# Altium schematic sheet BLE.SchDoc
size A; SheetNumber: 5; SheetTotal: 5
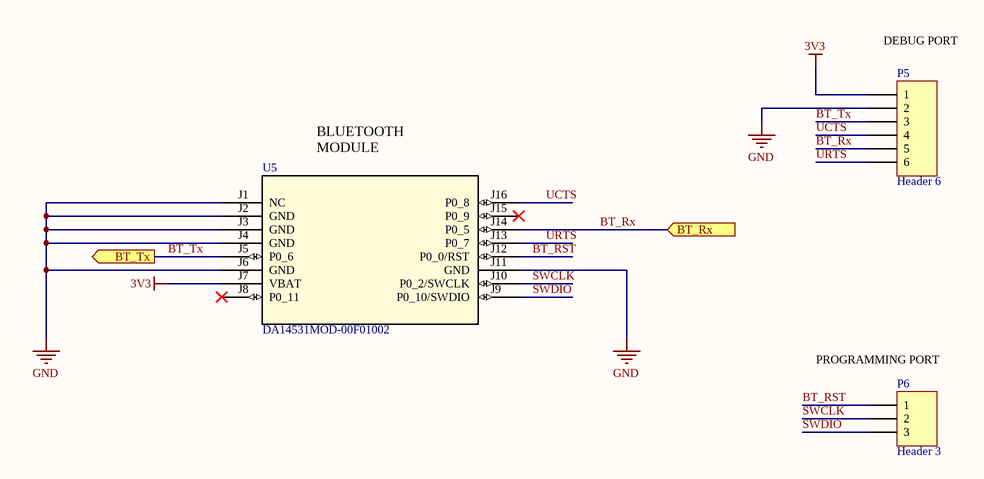
[diagram p0: BLE.SchDoc]

## Parts
P5  Header 6  [HDR1X6]
P6  Header 3  [HDR1X3]
U5  DA14531MOD-00F01002  [DA14531MOD_REN]

## Ports
BT_Rx (in), BT_Tx (out)

## Nets
3V3: P5.1 U5.J7(VBAT)
GND: P5.2 U5.J1(NC) U5.J2(GND) U5.J3(GND) U5.J4(GND) U5.J6(GND) U5.J11(GND)
BT_RST: P6.1 U5.J12(P0_0/RST)
BT_Rx: P5.5 U5.J14(P0_5) ; port BT_Rx
BT_Tx: P5.3 U5.J5(P0_6) ; port BT_Tx
SWCLK: P6.2 U5.J10(P0_2/SWCLK)
SWDIO: P6.3 U5.J9(P0_10/SWDIO)
UCTS: P5.4 U5.J16(P0_8)
URTS: P5.6 U5.J13(P0_7)

Not connected (* = marked no-connect by the designer): U5 J8(P0_11)* J15(P0_9)*

## Notes on the sheet
- (near P5) DEBUG PORT
- (near U5) BLUETOOTH MODULE
- (near P6) PROGRAMMING PORT

## Library data of the parts
P5 = Header 6: Header, 6-Pin; LatestRevisionDate: 17-Jul-2002; LatestRevisionNote: Re-released for DXP Platform.; Publisher: Altium Limited
P6 = Header 3: Header, 3-Pin; LatestRevisionDate: 17-Jul-2002; LatestRevisionNote: Re-released for DXP Platform.; Publisher: Altium Limited
U5 = DA14531MOD-00F01002: No Description Available; Mfr_Name: Renesas Electronics; RefDes: RefDes; Type: Type